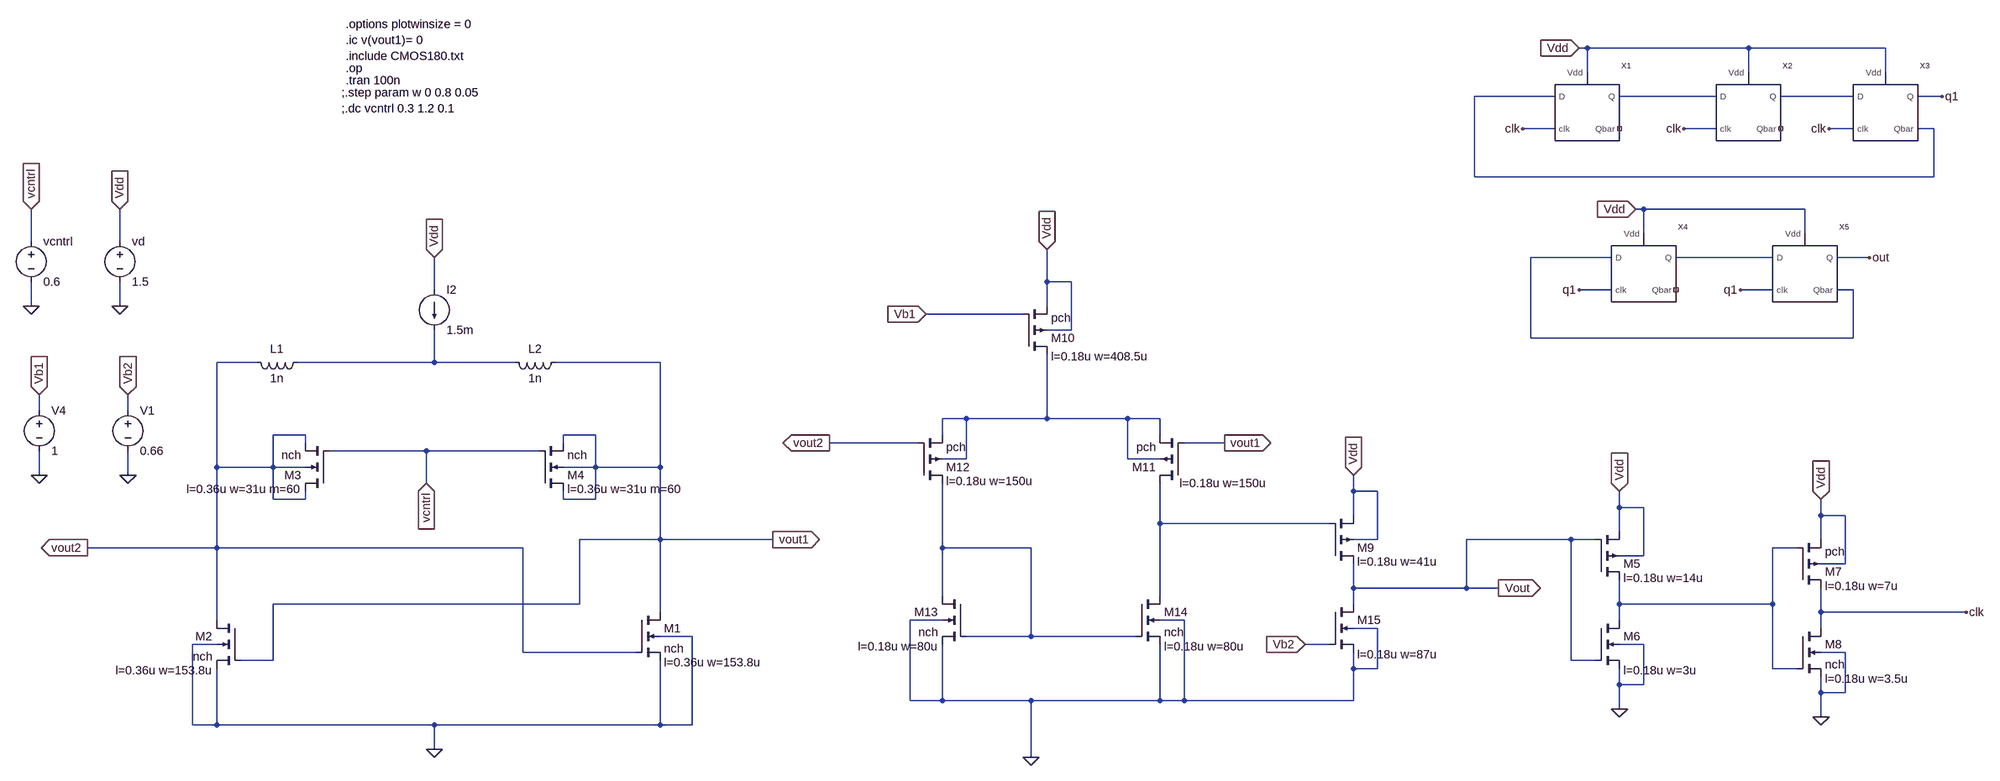
[diagram p0: schematic WithDividerVCO_final.asc]
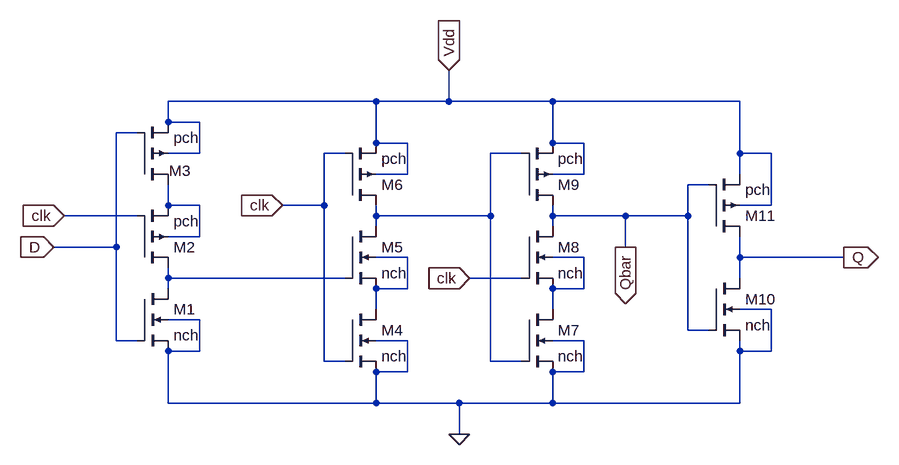
[diagram p1: sub-circuit dff_sym.asc]
WithDividerVCO_final.asc, the LTspice schematic file:
Version 4
SHEET 1 5428 1300
WIRE 2960 -1120 2944 -1120
WIRE 3280 -1120 2960 -1120
WIRE 3552 -1120 3280 -1120
WIRE 2960 -1072 2960 -1120
WIRE 3280 -1072 3280 -1120
WIRE 3552 -1072 3552 -1120
WIRE 2896 -1024 2736 -1024
WIRE 3216 -1024 3024 -1024
WIRE 3488 -1024 3344 -1024
WIRE 3664 -1024 3616 -1024
WIRE 2896 -960 2832 -960
WIRE 3216 -960 3152 -960
WIRE 3488 -960 3440 -960
WIRE 3648 -960 3616 -960
WIRE 2736 -864 2736 -1024
WIRE 3648 -864 3648 -960
WIRE 3648 -864 2736 -864
WIRE 3072 -800 3056 -800
WIRE 3392 -800 3072 -800
WIRE 3072 -752 3072 -800
WIRE 3392 -752 3392 -800
WIRE -128 -736 -128 -800
WIRE 48 -736 48 -800
WIRE 3008 -704 2848 -704
WIRE 3328 -704 3136 -704
WIRE 3520 -704 3456 -704
WIRE 1888 -656 1888 -720
WIRE 1936 -656 1888 -656
WIRE 672 -640 672 -704
WIRE 3008 -640 2944 -640
WIRE 3328 -640 3264 -640
WIRE 3488 -640 3456 -640
WIRE -128 -608 -128 -656
WIRE 48 -608 48 -656
WIRE 1888 -608 1888 -656
WIRE 1840 -592 1648 -592
WIRE 1936 -560 1936 -656
WIRE 1936 -560 1888 -560
WIRE 2848 -544 2848 -704
WIRE 3488 -544 3488 -640
WIRE 3488 -544 2848 -544
WIRE 320 -496 240 -496
WIRE 672 -496 672 -560
WIRE 672 -496 400 -496
WIRE 832 -496 672 -496
WIRE 1120 -496 912 -496
WIRE -112 -400 -112 -432
WIRE 64 -400 64 -432
WIRE 1728 -384 1680 -384
WIRE 1888 -384 1888 -512
WIRE 1888 -384 1728 -384
WIRE 2048 -384 1888 -384
WIRE 2112 -384 2048 -384
WIRE 416 -352 352 -352
WIRE 992 -352 928 -352
WIRE 1680 -352 1680 -384
WIRE 2112 -352 2112 -384
WIRE 416 -336 416 -352
WIRE 928 -336 928 -352
WIRE 1632 -336 1456 -336
WIRE 2240 -336 2160 -336
WIRE 656 -320 464 -320
WIRE 880 -320 656 -320
WIRE 1728 -304 1728 -384
WIRE 1728 -304 1680 -304
WIRE 2048 -304 2048 -384
WIRE 2112 -304 2048 -304
WIRE 240 -288 240 -496
WIRE 352 -288 352 -352
WIRE 352 -288 240 -288
WIRE 416 -288 352 -288
WIRE 992 -288 992 -352
WIRE 992 -288 928 -288
WIRE 1120 -288 1120 -496
WIRE 1120 -288 992 -288
WIRE -112 -272 -112 -320
WIRE 64 -272 64 -320
WIRE 656 -256 656 -320
WIRE 2496 -240 2496 -272
WIRE 2544 -240 2496 -240
WIRE 352 -224 352 -288
WIRE 416 -224 416 -240
WIRE 416 -224 352 -224
WIRE 928 -224 928 -240
WIRE 992 -224 992 -288
WIRE 992 -224 928 -224
WIRE 3024 -208 3024 -240
WIRE 3072 -208 3024 -208
WIRE 2496 -192 2496 -240
WIRE 3424 -192 3424 -224
WIRE 3472 -192 3424 -192
WIRE 2112 -176 2112 -256
WIRE 2448 -176 2112 -176
WIRE 3024 -160 3024 -208
WIRE 1120 -144 1120 -288
WIRE 1120 -144 960 -144
WIRE 1344 -144 1120 -144
WIRE 2544 -144 2544 -240
WIRE 2544 -144 2496 -144
WIRE 2928 -144 2720 -144
WIRE 2976 -144 2928 -144
WIRE 3424 -144 3424 -192
WIRE 240 -128 240 -288
WIRE 240 -128 -16 -128
WIRE 848 -128 240 -128
WIRE 1680 -128 1680 -256
WIRE 1856 -128 1680 -128
WIRE 3376 -128 3328 -128
WIRE 3072 -112 3072 -208
WIRE 3072 -112 3024 -112
WIRE 3472 -96 3472 -192
WIRE 3472 -96 3424 -96
WIRE 2496 -48 2496 -96
WIRE 2720 -48 2720 -144
WIRE 2720 -48 2496 -48
WIRE 2784 -48 2720 -48
WIRE 1680 -32 1680 -128
WIRE 2112 -32 2112 -176
WIRE 960 -16 960 -144
WIRE 960 -16 352 -16
WIRE 2496 -16 2496 -48
WIRE 3024 -16 3024 -64
WIRE 3328 -16 3328 -128
WIRE 3328 -16 3024 -16
WIRE 1120 0 1120 -144
WIRE 3424 0 3424 -48
WIRE 3712 0 3424 0
WIRE 240 16 240 -128
WIRE 1680 16 1616 16
WIRE 2160 16 2112 16
WIRE 3024 16 3024 -16
WIRE 2544 32 2496 32
WIRE 3424 32 3424 0
WIRE 1184 48 1120 48
WIRE 1856 48 1856 -128
WIRE 1856 48 1728 48
WIRE 2064 48 1856 48
WIRE 240 64 192 64
WIRE 2448 64 2400 64
WIRE 3072 64 3024 64
WIRE 848 80 848 -128
WIRE 1072 80 848 80
WIRE 3472 80 3424 80
WIRE 352 96 352 -16
WIRE 352 96 288 96
WIRE 2928 96 2928 -144
WIRE 2976 96 2928 96
WIRE 2496 112 2496 80
WIRE 2544 112 2544 32
WIRE 2544 112 2496 112
WIRE 3328 112 3328 -16
WIRE 3376 112 3328 112
WIRE 3024 144 3024 112
WIRE 3072 144 3072 64
WIRE 3072 144 3024 144
WIRE 3424 160 3424 128
WIRE 3472 160 3472 80
WIRE 3472 160 3424 160
WIRE 1616 176 1616 16
WIRE 1680 176 1680 64
WIRE 1680 176 1616 176
WIRE 1856 176 1680 176
WIRE 2112 176 2112 64
WIRE 2112 176 1856 176
WIRE 2160 176 2160 16
WIRE 2160 176 2112 176
WIRE 2496 176 2496 112
WIRE 2496 176 2160 176
WIRE 3024 192 3024 144
WIRE 3424 208 3424 160
WIRE 192 224 192 64
WIRE 240 224 240 112
WIRE 240 224 192 224
WIRE 672 224 240 224
WIRE 1120 224 1120 96
WIRE 1120 224 672 224
WIRE 1184 224 1184 48
WIRE 1184 224 1120 224
WIRE 672 272 672 224
WIRE 1856 288 1856 176
FLAG 48 -608 0
FLAG 672 -704 Vdd
IOPIN 672 -704 In
FLAG 48 -800 Vdd
IOPIN 48 -800 In
FLAG 1344 -144 vout1
IOPIN 1344 -144 Out
FLAG 672 272 0
FLAG -16 -128 vout2
IOPIN -16 -128 Out
FLAG -128 -608 0
FLAG -128 -800 vcntrl
IOPIN -128 -800 In
FLAG 656 -256 vcntrl
IOPIN 656 -256 In
FLAG 1856 288 0
FLAG -112 -272 0
FLAG 3024 192 0
FLAG 3424 208 0
FLAG 1888 -720 Vdd
IOPIN 1888 -720 In
FLAG 3024 -240 Vdd
IOPIN 3024 -240 In
FLAG 3424 -224 Vdd
IOPIN 3424 -224 In
FLAG 1456 -336 vout2
IOPIN 1456 -336 Out
FLAG 2496 -272 Vdd
IOPIN 2496 -272 In
FLAG 2240 -336 vout1
IOPIN 2240 -336 Out
FLAG 64 -272 0
FLAG -112 -432 Vb1
IOPIN -112 -432 In
FLAG 64 -432 Vb2
IOPIN 64 -432 In
FLAG 1648 -592 Vb1
IOPIN 1648 -592 In
FLAG 2400 64 Vb2
IOPIN 2400 64 In
FLAG 2784 -48 Vout
IOPIN 2784 -48 Out
FLAG 2944 -1120 Vdd
IOPIN 2944 -1120 In
FLAG 2832 -960 clk
FLAG 3152 -960 clk
FLAG 3440 -960 clk
FLAG 3664 -1024 q1
FLAG 3056 -800 Vdd
IOPIN 3056 -800 In
FLAG 2944 -640 q1
FLAG 3520 -704 out
FLAG 3264 -640 q1
FLAG 3712 0 clk
SYMBOL voltage 48 -752 R0
WINDOW 123 0 0 Left 0
WINDOW 39 0 0 Left 0
SYMATTR InstName vd
SYMATTR Value 1.5
SYMBOL nmos4 288 16 M0
WINDOW 123 56 100 Left 2
SYMATTR Value2 l=0.36u w=153.8u
SYMATTR InstName M2
SYMATTR Value nch
SYMBOL current 672 -640 R0
WINDOW 123 0 0 Left 0
WINDOW 39 0 0 Left 0
SYMATTR InstName I2
SYMATTR Value 1.5m
SYMBOL ind 416 -512 R90
WINDOW 0 5 56 VBottom 2
WINDOW 3 32 56 VTop 2
SYMATTR InstName L1
SYMATTR Value 1n
SYMATTR SpiceLine Rser=1.5
SYMBOL nmos4 1072 0 R0
WINDOW 123 56 100 Left 2
SYMATTR Value2 l=0.36u w=153.8u
SYMATTR InstName M1
SYMATTR Value nch
SYMBOL voltage -128 -752 R0
WINDOW 123 0 0 Left 0
WINDOW 39 0 0 Left 0
SYMATTR InstName vcntrl
SYMATTR Value 0.6
SYMBOL ind 928 -512 R90
WINDOW 0 5 56 VBottom 2
WINDOW 3 32 56 VTop 2
SYMATTR InstName L2
SYMATTR Value 1n
SYMATTR SpiceLine Rser=1.5
SYMBOL nmos4 464 -240 R180
WINDOW 123 56 4 Left 2
SYMATTR Value2 l=0.36u w=31u m=60
SYMATTR InstName M3
SYMATTR Value nch
SYMBOL nmos4 880 -240 M180
WINDOW 123 56 4 Left 2
SYMATTR Value2 l=0.36u w=31u m=60
SYMATTR InstName M4
SYMATTR Value nch
SYMBOL pmos4 1840 -512 M180
WINDOW 123 56 -4 Left 2
SYMATTR Value2 l=0.18u w=408.5u
SYMATTR InstName M10
SYMATTR Value pch
SYMBOL pmos4 2160 -256 R180
WINDOW 123 -164 0 Left 2
SYMATTR Value2 l=0.18u w=150u
SYMATTR InstName M11
SYMATTR Value pch
SYMBOL pmos4 1632 -256 M180
WINDOW 123 56 4 Left 2
SYMATTR Value2 l=0.18u w=150u
SYMATTR InstName M12
SYMATTR Value pch
SYMBOL voltage -112 -416 R0
WINDOW 123 0 0 Left 0
WINDOW 39 0 0 Left 0
SYMATTR InstName V4
SYMATTR Value 1
SYMBOL nmos4 1728 -32 M0
WINDOW 123 56 100 Left 2
SYMATTR Value2 l=0.18u w=80u
SYMATTR InstName M13
SYMATTR Value nch
SYMBOL nmos4 2064 -32 R0
WINDOW 123 56 100 Left 2
SYMATTR Value2 l=0.18u w=80u
SYMATTR InstName M14
SYMATTR Value nch
SYMBOL pmos4 2976 -64 M180
WINDOW 123 56 4 Left 2
WINDOW 3 56 72 Invisible 2
SYMATTR Value2 l=0.18u w=14u
SYMATTR Value pch
SYMATTR InstName M5
SYMBOL nmos4 2976 16 R0
WINDOW 123 56 100 Left 2
WINDOW 3 56 72 Invisible 2
SYMATTR Value2 l=0.18u w=3u
SYMATTR Value nch
SYMATTR InstName M6
SYMBOL pmos4 3376 -48 M180
WINDOW 123 56 4 Left 2
SYMATTR Value2 l=0.18u w=7u
SYMATTR InstName M7
SYMATTR Value pch
SYMBOL nmos4 3376 32 R0
WINDOW 123 56 100 Left 2
SYMATTR Value2 l=0.18u w=3.5u
SYMATTR InstName M8
SYMATTR Value nch
SYMBOL pmos4 2448 -96 M180
WINDOW 123 56 4 Left 2
WINDOW 3 56 72 Invisible 2
SYMATTR Value2 l=0.18u w=41u
SYMATTR Value pch
SYMATTR InstName M9
SYMBOL nmos4 2448 -16 R0
WINDOW 123 56 100 Left 2
WINDOW 3 56 72 Invisible 2
SYMATTR Value2 l=0.18u w=87u
SYMATTR Value nch
SYMATTR InstName M15
SYMBOL voltage 64 -416 R0
WINDOW 123 0 0 Left 0
WINDOW 39 0 0 Left 0
SYMATTR InstName V1
SYMATTR Value 0.66
SYMBOL dff_sym 2960 -992 R0
SYMATTR InstName X1
SYMBOL dff_sym 3280 -992 R0
SYMATTR InstName X2
SYMBOL dff_sym 3552 -992 R0
SYMATTR InstName X3
SYMBOL dff_sym 3072 -672 R0
SYMATTR InstName X4
SYMBOL dff_sym 3392 -672 R0
SYMATTR InstName X5
TEXT 496 -1104 Left 2 !.include CMOS180.txt
TEXT 496 -1080 Left 2 !.op
TEXT 496 -1056 Left 2 !.tran 100n
TEXT 496 -1136 Left 2 !.ic v(vout1)= 0
TEXT 496 -1168 Left 2 !.options plotwinsize = 0
TEXT 488 -1032 Left 2 !;.step param w 0 0.8 0.05
TEXT 488 -1000 Left 2 !;.dc vcntrl 0.3 1.2 0.1

dff_sym.asc, the sub-circuit schematic file:
Version 4
SHEET 1 1948 680
WIRE 1056 -128 736 -128
WIRE 1168 -128 1168 -176
WIRE 1168 -128 1056 -128
WIRE 1328 -128 1168 -128
WIRE 1616 -128 1328 -128
WIRE 736 -96 736 -128
WIRE 784 -96 736 -96
WIRE 688 -80 656 -80
WIRE 1056 -64 1056 -128
WIRE 1104 -64 1056 -64
WIRE 1328 -64 1328 -128
WIRE 1376 -64 1328 -64
WIRE 784 -48 784 -96
WIRE 784 -48 736 -48
WIRE 1008 -48 976 -48
WIRE 1280 -48 1232 -48
WIRE 1616 -48 1616 -128
WIRE 1664 -48 1616 -48
WIRE 1104 -16 1104 -64
WIRE 1104 -16 1056 -16
WIRE 1376 -16 1376 -64
WIRE 1376 -16 1328 -16
WIRE 1616 -16 1616 -48
WIRE 1568 0 1536 0
WIRE 736 32 736 0
WIRE 784 32 736 32
WIRE 976 32 976 -48
WIRE 976 32 912 32
WIRE 1664 32 1664 -48
WIRE 1664 32 1616 32
WIRE 688 48 576 48
WIRE 1056 48 1056 32
WIRE 1232 48 1232 -48
WIRE 1232 48 1056 48
WIRE 1328 48 1328 32
WIRE 1440 48 1328 48
WIRE 1536 48 1536 0
WIRE 1536 48 1440 48
WIRE 1056 64 1056 48
WIRE 1328 64 1328 48
WIRE 784 80 784 32
WIRE 784 80 736 80
WIRE 656 96 656 -80
WIRE 656 96 560 96
WIRE 1440 96 1440 48
WIRE 1104 112 1056 112
WIRE 1376 112 1328 112
WIRE 1616 112 1616 80
WIRE 1776 112 1616 112
WIRE 736 144 736 128
WIRE 1008 144 736 144
WIRE 1280 144 1200 144
WIRE 1616 144 1616 112
WIRE 736 160 736 144
WIRE 1104 160 1104 112
WIRE 1104 160 1056 160
WIRE 1376 160 1376 112
WIRE 1376 160 1328 160
WIRE 1056 192 1056 160
WIRE 1328 192 1328 160
WIRE 1664 192 1616 192
WIRE 784 208 736 208
WIRE 1536 224 1536 48
WIRE 1568 224 1536 224
WIRE 656 240 656 96
WIRE 688 240 656 240
WIRE 1104 240 1056 240
WIRE 1376 240 1328 240
WIRE 784 256 784 208
WIRE 784 256 736 256
WIRE 1616 256 1616 240
WIRE 1664 256 1664 192
WIRE 1664 256 1616 256
WIRE 976 272 976 32
WIRE 1008 272 976 272
WIRE 1232 272 1232 48
WIRE 1280 272 1232 272
WIRE 1104 288 1104 240
WIRE 1104 288 1056 288
WIRE 1376 288 1376 240
WIRE 1376 288 1328 288
WIRE 736 336 736 256
WIRE 1056 336 1056 288
WIRE 1056 336 736 336
WIRE 1184 336 1056 336
WIRE 1328 336 1328 288
WIRE 1328 336 1184 336
WIRE 1616 336 1616 256
WIRE 1616 336 1328 336
WIRE 1184 384 1184 336
FLAG 576 48 clk
IOPIN 576 48 In
FLAG 1776 112 Q
IOPIN 1776 112 Out
FLAG 560 96 D
IOPIN 560 96 In
FLAG 912 32 clk
IOPIN 912 32 In
FLAG 1200 144 clk
IOPIN 1200 144 In
FLAG 1168 -176 Vdd
IOPIN 1168 -176 In
FLAG 1440 96 Qbar
IOPIN 1440 96 Out
FLAG 1184 384 0
SYMBOL pmos4 688 0 M180
WINDOW 0 49 21 Left 2
SYMATTR Value2 l=180n w=1.44u
SYMATTR InstName M3
SYMATTR Value pch
SYMBOL pmos4 1008 32 M180
SYMATTR Value2 l=180n w=0.72u
SYMATTR InstName M6
SYMATTR Value pch
SYMBOL pmos4 1280 32 M180
SYMATTR Value2 l=180n w=0.72u
SYMATTR InstName M9
SYMATTR Value pch
SYMBOL pmos4 1568 80 M180
SYMATTR Value2 l=180n w=0.72u
SYMATTR InstName M11
SYMATTR Value pch
SYMBOL pmos4 688 128 M180
SYMATTR Value2 l=180n w=1.44u
SYMATTR InstName M2
SYMATTR Value pch
SYMBOL nmos4 688 160 R0
SYMATTR Value2 l=180n w=0.36u
SYMATTR InstName M1
SYMATTR Value nch
SYMBOL nmos4 1008 64 R0
SYMATTR Value2 l=180n w=0.72u
SYMATTR InstName M5
SYMATTR Value nch
SYMBOL nmos4 1008 192 R0
SYMATTR Value2 l=180n w=0.72u
SYMATTR InstName M4
SYMATTR Value nch
SYMBOL nmos4 1280 64 R0
SYMATTR Value2 l=180n w=0.72u
SYMATTR InstName M8
SYMATTR Value nch
SYMBOL nmos4 1280 192 R0
SYMATTR Value2 l=180n w=0.72u
SYMATTR InstName M7
SYMATTR Value nch
SYMBOL nmos4 1568 144 R0
SYMATTR Value2 l=180n w=0.36u
SYMATTR InstName M10
SYMATTR Value nch

The netlist it stands for:
* WithDividerVCO_final.asc
vd Vdd 0 1.5
M2 vout2 vout1 0 0 nch l=0.36u w=153.8u
I2 Vdd N006 1.5m
L1 N006 vout2 1n Rser=1.5
M1 vout1 vout2 0 0 nch l=0.36u w=153.8u
vcntrl vcntrl 0 0.6
L2 vout1 N006 1n Rser=1.5
M3 vout2 vcntrl vout2 vout2 nch l=0.36u w=31u m=60
M4 vout1 vcntrl vout1 vout1 nch l=0.36u w=31u m=60
M10 N007 Vb1 Vdd Vdd pch l=0.18u w=408.5u
M11 N008 vout1 N007 N007 pch l=0.18u w=150u
M12 N009 vout2 N007 N007 pch l=0.18u w=150u
V4 Vb1 0 1
M13 N009 N009 0 0 nch l=0.18u w=80u
M14 N008 N009 0 0 nch l=0.18u w=80u
M5 N010 Vout Vdd Vdd pch l=0.18u w=14u
M6 N010 Vout 0 0 nch l=0.18u w=3u
M7 clk N010 Vdd Vdd pch l=0.18u w=7u
M8 clk N010 0 0 nch l=0.18u w=3.5u
M9 Vout N008 Vdd Vdd pch l=0.18u w=41u
M15 Vout Vb2 0 0 nch l=0.18u w=87u
V1 Vb2 0 0.66
XX1 clk N001 Vdd N002 NC_01 dff_sym
XX2 clk N002 Vdd N003 NC_02 dff_sym
XX3 clk N003 Vdd q1 N001 dff_sym
XX4 q1 N004 Vdd N005 NC_03 dff_sym
XX5 q1 N005 Vdd out N004 dff_sym

* block symbol definitions
.subckt dff_sym clk D Vdd Q Qbar
M3 N002 D Vdd Vdd pch l=180n w=1.44u
M6 N001 clk Vdd Vdd pch l=180n w=0.72u
M9 Qbar N001 Vdd Vdd pch l=180n w=0.72u
M11 Q Qbar Vdd Vdd pch l=180n w=0.72u
M2 N005 clk N002 N002 pch l=180n w=1.44u
M1 N005 D 0 0 nch l=180n w=0.36u
M5 N001 N005 N003 N003 nch l=180n w=0.72u
M4 N003 clk 0 0 nch l=180n w=0.72u
M8 Qbar clk N004 N004 nch l=180n w=0.72u
M7 N004 N001 0 0 nch l=180n w=0.72u
M10 Q Qbar 0 0 nch l=180n w=0.36u
.ends dff_sym

.model NMOS NMOS
.model PMOS PMOS
.lib standard.mos
.include CMOS180.txt
.op
.tran 100n
.ic v(vout1)= 0
.options plotwinsize = 0
;.step param w 0 0.8 0.05
;.dc vcntrl 0.3 1.2 0.1
.backanno
.end